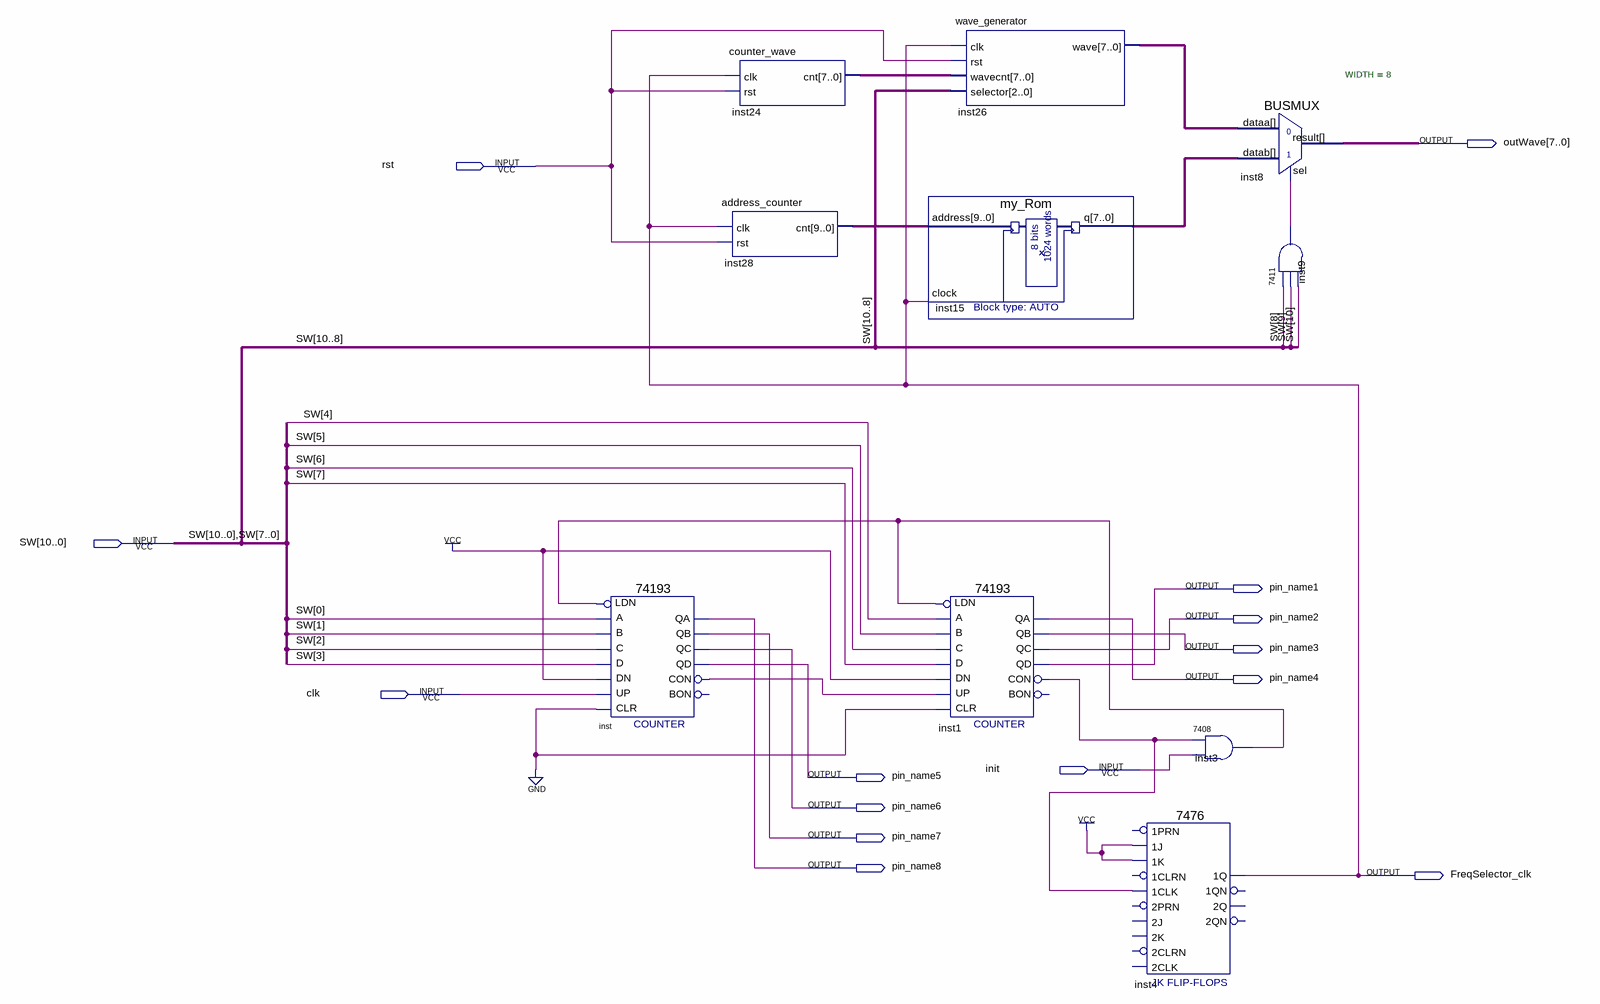
[diagram p0: schematic sheet]
// Quartus schematic frequency_selector.bdf as structural Verilog: 10 symbols, 14 pins
module frequency_selector (
  input  rst,
  input  [10:0] SW,
  input  clk,
  input  init,
  output [7:0] outWave,
  output pin_name1,
  output pin_name2,
  output pin_name3,
  output pin_name4,
  output pin_name5,
  output pin_name6,
  output pin_name7,
  output pin_name8,
  output FreqSelector_clk
);

  wire inst1_con, inst3_1, inst9_1, inst_con;
  wire [7:0] inst15_q, inst24_cnt, inst26_wave;
  wire [9:0] inst28_cnt;

  \74193  inst (
    .D(SW[3]), .C(SW[2]), .B(SW[1]), .A(SW[0]), .CLR(1'b0), .UP(clk), .DN(1'b1), .LDN(inst3_1),
    .QB(pin_name7), .QA(pin_name8), .CON(inst_con), .QD(pin_name5), .QC(pin_name6));  // open: BON
  counter_wave inst24 (.clk(FreqSelector_clk), .rst(rst), .cnt(inst24_cnt));
  address_counter inst28 (.clk(FreqSelector_clk), .rst(rst), .cnt(inst28_cnt));
  my_Rom inst15 (.address(inst28_cnt), .clock(FreqSelector_clk), .q(inst15_q));
  \74193  inst1 (
    .D(SW[7]), .C(SW[6]), .B(SW[5]), .A(SW[4]), .CLR(1'b0), .UP(inst_con), .DN(1'b1), .LDN(inst3_1),
    .QB(pin_name3), .QA(pin_name4), .CON(inst1_con), .QD(pin_name1), .QC(pin_name2));  // open: BON
  wave_generator inst26 (
    .clk(FreqSelector_clk), .rst(rst), .wavecnt(inst24_cnt), .selector(SW[10:8]), .wave(inst26_wave));
  \7476  inst4 (
    .\1J (1'b1), .\1K (1'b1), .\1CLK (inst1_con), .\1Q (FreqSelector_clk));  // open: 1PRN, 2PRN, 2J, 1CLRN, 2K, 2CLRN, 2CLK, 2QN, 2Q, 1QN
  BUSMUX #(.WIDTH(8)) inst8 (.datab(inst15_q), .sel(inst9_1), .dataa(inst26_wave), .result(outWave));
  \7408  inst3 (.\3 (init), .\2 (inst1_con), .\1 (inst3_1));
  \7411  inst9 (.\2 (SW[8]), .\3 (SW[9]), .\4 (SW[10]), .\1 (inst9_1));
endmodule
